# Altium schematic sheet STM32F103-Keypad.schdoc
size 316 x 201 mm
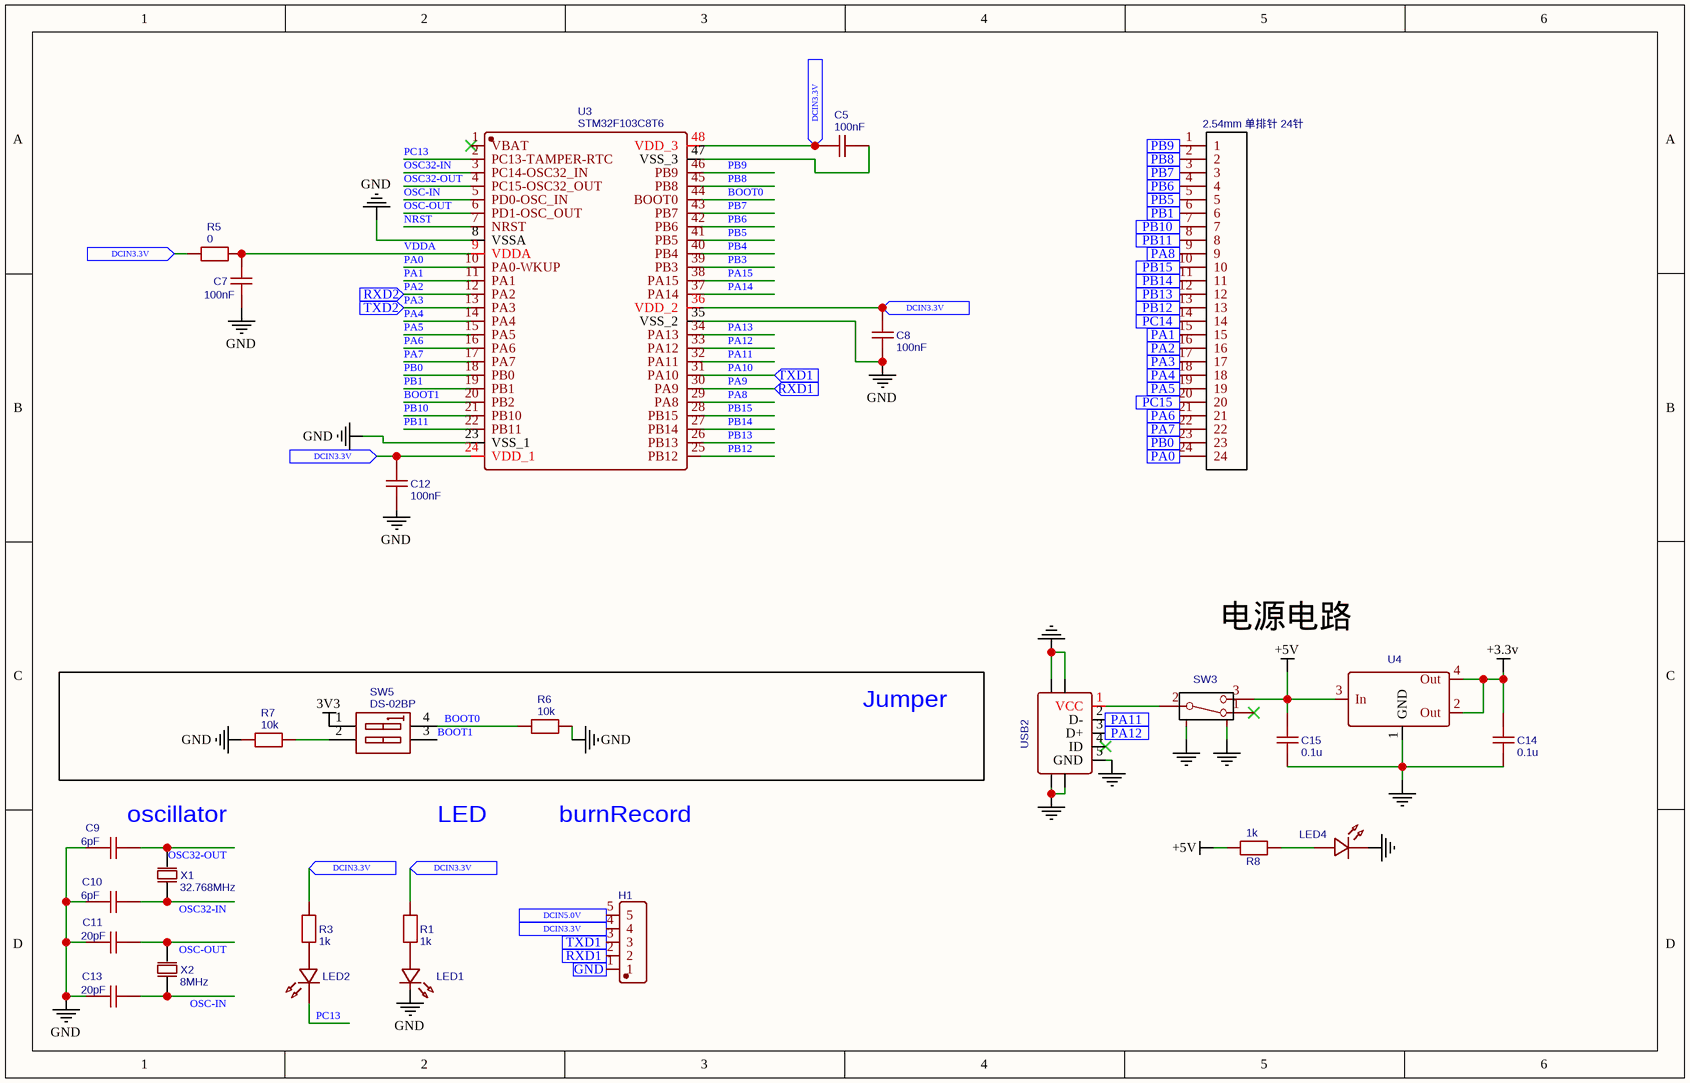
[diagram p0: STM32F103-Keypad.schdoc]

## Parts
C5  100nF  [C0603]
C7  100nF  [C0603]
C8  100nF  [C0603]
C9  6pF  [C0603]
C10  6pF  [C0603]
C11  20pF  [C0603]
C12  100nF  [C0603]
C13  20pF  [C0603]
C14  0.1u  [C0805]
C15  0.1u  [C0805]
H1  A2541WV-5P  [HDR-TH_5P-P2.54-V]  (value not drawn)
LED1  LED-0603_R  [LED0603_RED]  (value not drawn)
LED2  LED-0603_R  [LED0603_RED]  (value not drawn)
LED4  LED-0805_R  [LED0805_RED]  (value not drawn)
NO  2.54mm 单排针 24针  [2.54MM 单排针 24针]
R1  1k  [R0603]
R3  1k  [R0603]
R5  0  [R0603]
R6  10k  [R0603]
R7  10k  [R0603]
R8  1k  [R0805]
SW3  SS-12D02-VG4  [SW-TH_SS-12D02-VG4]  (value not drawn)
SW5  DS-02BP  [SW-TH_DS-02XP]
U3  STM32F103C8T6  [LQFP-48_L7.0-W7.0-P0.50-LS9.0-BL]
U4  AMS1117-3.3_C369933-1  [SOT-223-4_L6.5-W3.5-P2.30-LS7.0-BR]  (value not drawn)
USB2  USB-Micro_2  [MICRO-USB-SMD_5P_C40957]  (value not drawn)
X1  32.768MHz  [HC-49US_L11.5-W4.5-P4.88]
X2  8MHz  [HC-49US_L11.5-W4.5-P4.88]

## Blocks framed on the sheet
Jumper: R6 R7 SW5

## Ports
DCIN3.3V (in), DCIN5.0V (in), GND (in), PA0 (in), PA1 (in), PA2 (in), PA3 (in), PA4 (in), PA5 (in), PA6 (in), PA7 (in), PA8 (in), PA11 (in), PA12 (in), PB0 (in), PB1 (in), PB5 (in), PB6 (in), PB7 (in), PB8 (in), PB9 (in), PB10 (in), PB11 (in), PB12 (in), PB13 (in), PB14 (in), PB15 (in), PC14 (in), PC15 (in), RXD1 (in), RXD2 (in), TXD1 (in), TXD2 (in)

## Nets
3V3: SW5.1(A1)
+3.3v: C14.2 U4.2(Out) U4.4(Out)
+5V: C15.2 R8.1 SW3.3 U4.3(In)
GND: C7.1 C8.2 C9.1 C10.1 C11.1 C13.1 C14.1 C15.1 LED1.2 LED4.2 R6.2 R7.1 SW3.4 SW3.5 U3.8(VSSA) U3.23(VSS_1) U3.35(VSS_2) U4.1(GND) USB2.5(GND) USB2.6(SH3) USB2.7(SH4) USB2.8(SH1) USB2.9(SH2)
BOOT0: R6.1 SW5.4(B3) U3.44(BOOT0)
BOOT1: SW5.3(A3) U3.20(PB2)
DCIN3.3V: C5.1 C8.1 C12.1 H1.4 R1.1 R3.2 R5.1 U3.24(VDD_1) U3.36(VDD_2) U3.48(VDD_3) ; port DCIN3.3V
DCIN5.0V: H1.5 ; port DCIN5.0V
GND: H1.1 ; port GND  [a separate net that carries the same name]
NRST: U3.7(NRST)
OSC32-IN: C10.2 U3.3(PC14-OSC32_IN) X1.1(OSC1)
OSC32-OUT: C9.2 U3.4(PC15-OSC32_OUT) X1.2(OSC2)
OSC-IN: C13.2 U3.5(PD0-OSC_IN) X2.1(OSC1)
OSC-OUT: C11.2 U3.6(PD1-OSC_OUT) X2.2(OSC2)
PA0: U3.10(PA0-WKUP)
PA0: NO.24 ; port PA0  [a separate net that carries the same name]
PA1: U3.11(PA1)
PA1: NO.15 ; port PA1  [a separate net that carries the same name]
PA2: U3.12(PA2) ; port RXD2
PA2: NO.16 ; port PA2  [a separate net that carries the same name]
PA3: U3.13(PA3) ; port TXD2
PA3: NO.17 ; port PA3  [a separate net that carries the same name]
PA4: U3.14(PA4)
PA4: NO.18 ; port PA4  [a separate net that carries the same name]
PA5: U3.15(PA5)
PA5: NO.19 ; port PA5  [a separate net that carries the same name]
PA6: U3.16(PA6)
PA6: NO.21 ; port PA6  [a separate net that carries the same name]
PA7: U3.17(PA7)
PA7: NO.22 ; port PA7  [a separate net that carries the same name]
PA8: U3.29(PA8)
PA8: NO.9 ; port PA8  [a separate net that carries the same name]
PA9: H1.2 U3.30(PA9) ; port RXD1
PA10: H1.3 U3.31(PA10) ; port TXD1
PA11: U3.32(PA11)
PA11: USB2.2(D-) ; port PA11  [a separate net that carries the same name]
PA12: U3.33(PA12)
PA12: USB2.3(D+) ; port PA12  [a separate net that carries the same name]
PA13: U3.34(PA13)
PA14: U3.37(PA14)
PA15: U3.38(PA15)
PB0: U3.18(PB0)
PB0: NO.23 ; port PB0  [a separate net that carries the same name]
PB1: U3.19(PB1)
PB1: NO.6 ; port PB1  [a separate net that carries the same name]
PB3: U3.39(PB3)
PB4: U3.40(PB4)
PB5: U3.41(PB5)
PB5: NO.5 ; port PB5  [a separate net that carries the same name]
PB6: U3.42(PB6)
PB6: NO.4 ; port PB6  [a separate net that carries the same name]
PB7: U3.43(PB7)
PB7: NO.3 ; port PB7  [a separate net that carries the same name]
PB8: U3.45(PB8)
PB8: NO.2 ; port PB8  [a separate net that carries the same name]
PB9: U3.46(PB9)
PB9: NO.1 ; port PB9  [a separate net that carries the same name]
PB10: U3.21(PB10)
PB10: NO.7 ; port PB10  [a separate net that carries the same name]
PB11: U3.22(PB11)
PB11: NO.8 ; port PB11  [a separate net that carries the same name]
PB12: U3.25(PB12)
PB12: NO.13 ; port PB12  [a separate net that carries the same name]
PB13: U3.26(PB13)
PB13: NO.12 ; port PB13  [a separate net that carries the same name]
PB14: U3.27(PB14)
PB14: NO.11 ; port PB14  [a separate net that carries the same name]
PB15: U3.28(PB15)
PB15: NO.10 ; port PB15  [a separate net that carries the same name]
PC13: LED2.2 U3.2(PC13-TAMPER-RTC)
PC14: NO.14 ; port PC14
PC15: NO.20 ; port PC15
VDDA: C7.2 R5.2 U3.9(VDDA)
NetC5_2: C5.2 U3.47(VSS_3)
NetLED1_1: LED1.1 R1.2
NetLED2_1: LED2.1 R3.1
NetLED4_1: LED4.1 R8.2
NetR7_2: R7.2 SW5.2(A2)
NetSW3_2: SW3.2 USB2.1(VCC)

Not connected (* = marked no-connect by the designer): C12 2; SW3 1*; U3 1(VBAT)*; USB2 4(ID)*

## Notes on the sheet
- 电源电路
- oscillator
- LED
- burnRecord
- Labels drawn without touching a wire or pin: GND

## Library data of the parts
C5 C7 C8 C12 = 100nF: nameAlias: Value(F); Contributor: LCEDA_Lib; spicePre: C; spiceSymbolName: C_0603_US
C9 C10 = 6pF: nameAlias: Value(F); Contributor: LCEDA_Lib; spicePre: C; spiceSymbolName: C_0603_US
C11 C13 = 20pF: nameAlias: Value(F); Contributor: LCEDA_Lib; spicePre: C; spiceSymbolName: C_0603_US
C14 C15 = 0.1u: nameAlias: Value(F); Contributor: LCEDA_Lib; spicePre: C; spiceSymbolName: C_0805_US
H1 = A2541WV-5P: BOM_Manufacturer: Changjiang Connectors; Contributor: LCSC; BOM_Supplier: LCSC; BOM_Supplier Part: C225480; BOM_Manufacturer Part: A2541WV-5P; spicePre: H; spiceSymbolName: A2541WV-5P
LED1 LED2 = LED-0603_R: BOM_Manufacturer: EVERLIGHT(台湾亿光); BOM_Manufacturer Part: 19-217/R6C-AL1M2VY/3T; Contributor: LCEDA_01; BOM_Supplier Part: C72044; BOM_Supplier: LCSC; spicePre: L; spiceSymbolName: LED-0603_R
LED4 = LED-0805_R: BOM_Manufacturer: EVERLIGHT(台湾亿光); BOM_Manufacturer Part: 17-21SURC/S530-A3/TR8; Contributor: LCEDA_Lib; BOM_Supplier Part: C72037; spicePre: L; spiceSymbolName: LED-0805_R
NO = 2.54mm 单排针 24针: Contributor: Tome; spicePre: U; spiceSymbolName: 2.54mm 单排针 24针
R1 R3 R8 = 1k: nameAlias: Value(Ω); Contributor: LCEDA_Lib; spicePre: R
  R1 R3: spiceSymbolName: R_0603_EU
  R8: spiceSymbolName: R_0805_EU
R5 = 0: nameAlias: Value(Ω); Contributor: LCEDA_Lib; spicePre: R; spiceSymbolName: R_0603_EU
R6 R7 = 10k: nameAlias: Value(Ω); Contributor: LCEDA_Lib; spicePre: R; spiceSymbolName: R_0603_EU
SW3 = SS-12D02-VG4: BOM_Manufacturer: Rectangular Connectors - Contacts; Contributor: LCSC; BOM_Supplier: LCSC; BOM_Supplier Part: C136719; BOM_Manufacturer Part: SS-12D02-VG4; spicePre: S; spiceSymbolName: SS-12D02-VG4
SW5 = DS-02BP: BOM_Manufacturer: HRO; Contributor: LCSC; BOM_Supplier: LCSC; BOM_Manufacturer Part: DS-02BP; BOM_Supplier Part: C129068; spicePre: S; spiceSymbolName: DS-02BP
U3 = STM32F103C8T6: BOM_Manufacturer: STMicroelectronics; SMT Type: Basic; timeStamp: 1455028086; BOM_Supplier: LCSC; BOM_Manufacturer Part: STM32F103C8T6; BOM_LCSC Assembly: Yes; image: //image.lceda.cn/szlcsc/C8734.jpg; BOM_Supplier Part: C8734; spicePre: U; spiceSymbolName: STM32F103C8T6
U4 = AMS1117-3.3_C369933-1: BOM_Manufacturer: KEXIN; Contributor: ky990703; SMT Type: Extend; BOM_Supplier: LCSC; BOM_Supplier Part: C369933; BOM_Manufacturer Part: AMS1117-3.3; BOM_LCSC Assembly: Yes; spicePre: U; spiceSymbolName: AMS1117-3.3_C369933-1
USB2 = USB-Micro_2: BOM_Manufacturer: ValuePro; Contributor: LCEDA_Lib; BOM_Supplier Part: C40957; BOM_Supplier: LCSC; spicePre: U; spiceSymbolName: USB-Micro_2
X1 = 32.768MHz: BOM_Manufacturer: ZheJiang East Crystal Elec; BOM_Manufacturer Part: B08000J067; nameAlias: Frequency; Contributor: LCSC; BOM_Supplier: LCSC; BOM_Supplier Part: C280058; spicePre: X; spiceSymbolName: B08000J067
X2 = 8MHz: BOM_Manufacturer: ZheJiang East Crystal Elec; BOM_Manufacturer Part: B08000J067; nameAlias: Frequency; Contributor: LCSC; BOM_Supplier: LCSC; BOM_Supplier Part: C280058; spicePre: X; spiceSymbolName: B08000J067